# EAGLE design JCarlos e Renato (EAGLE 6.2)
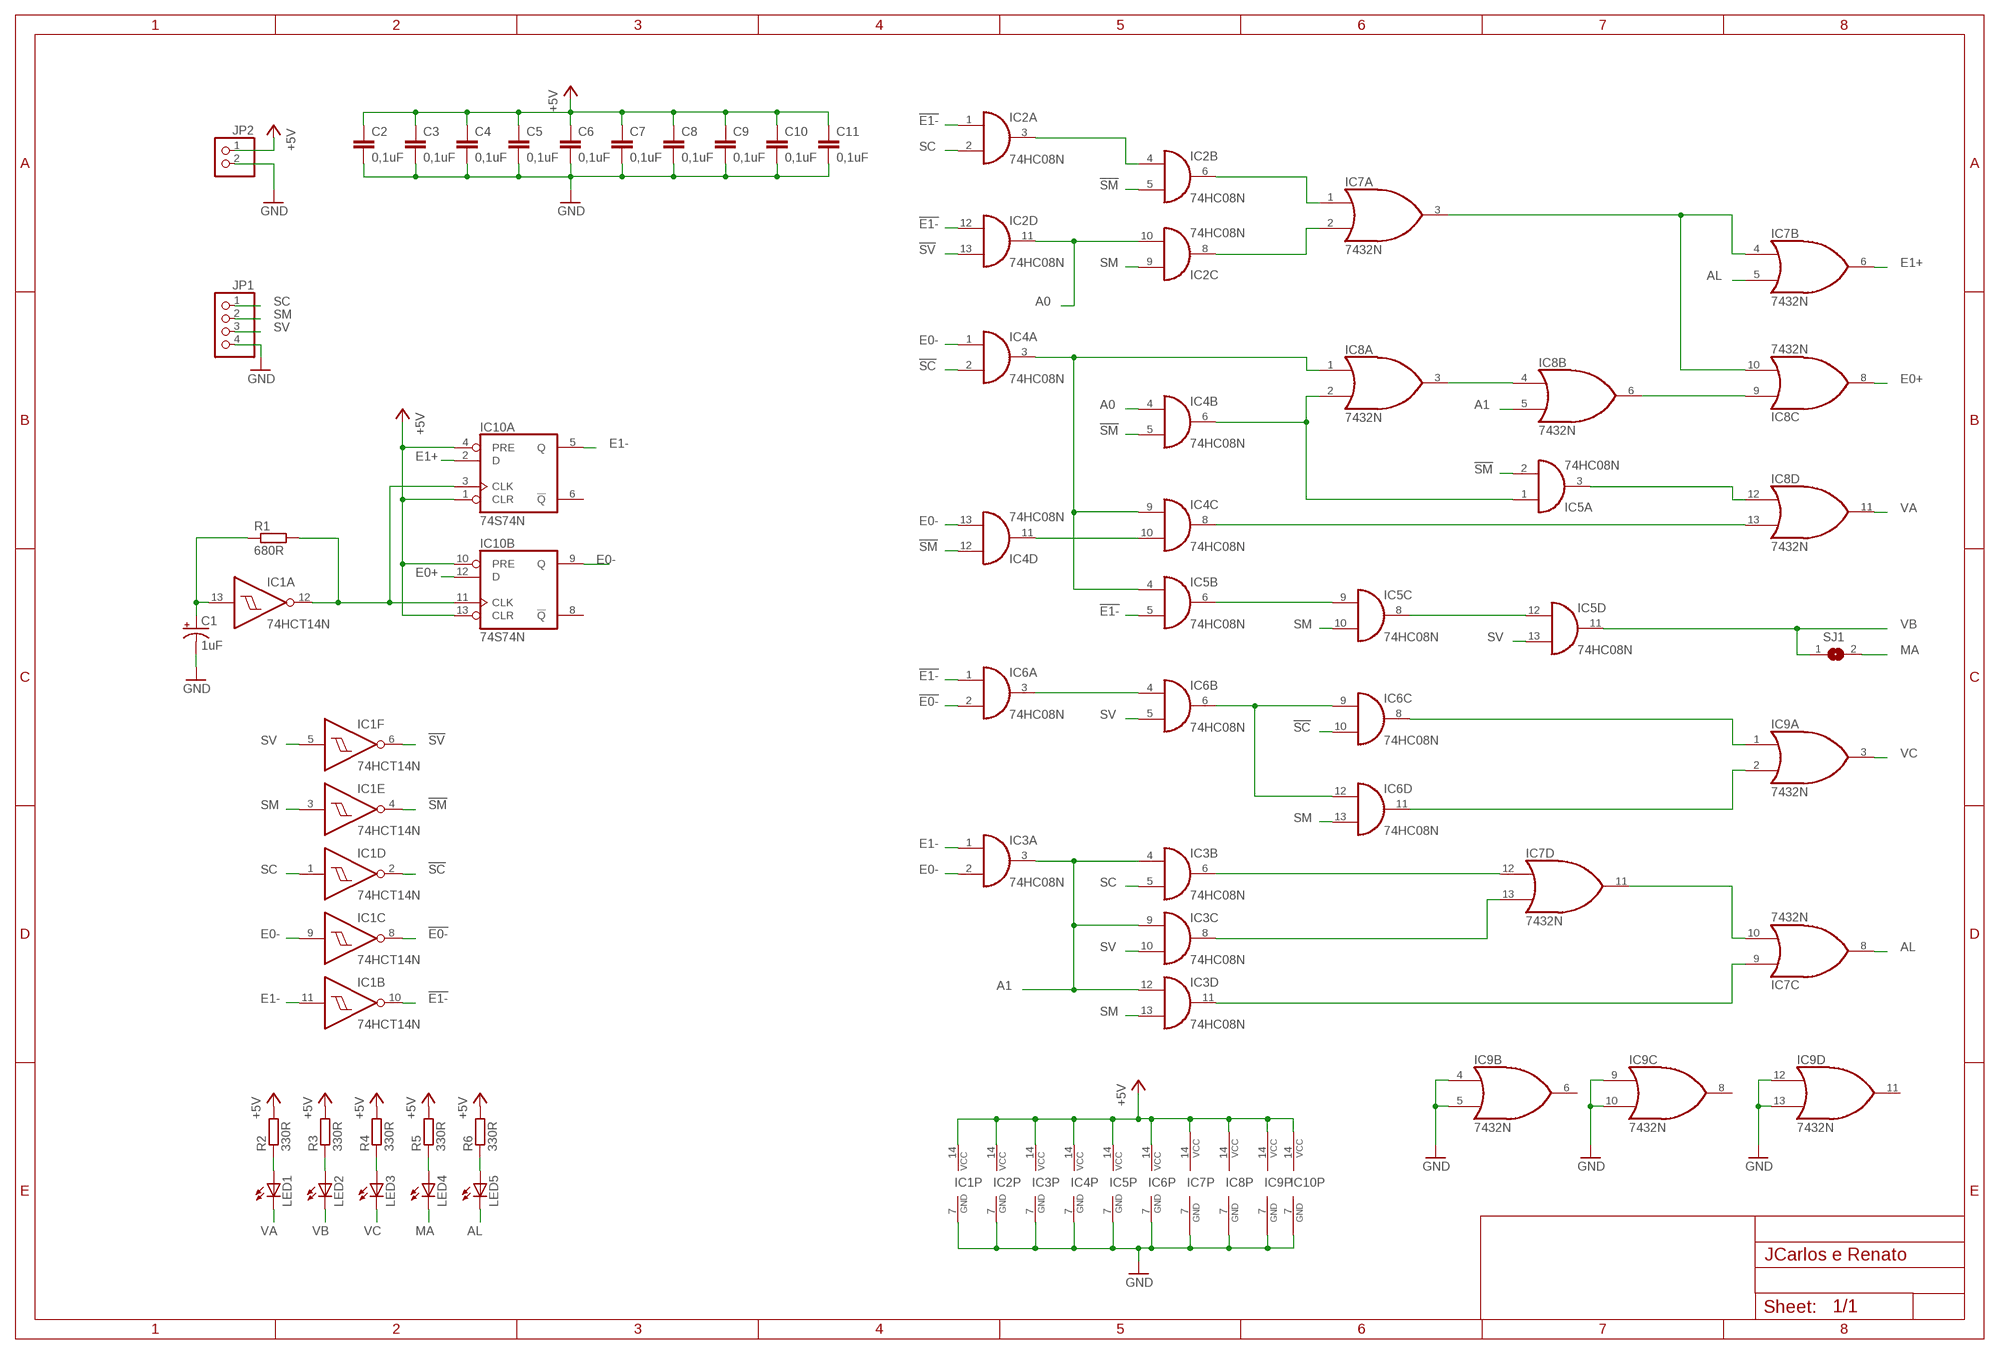
[diagram p0: schematic, sheet 1]

## Parts
C1  1uF  CPOL-USE5-6  [E5-6]
C2  0,1uF  C-EU050-025X075  [C050-025X075]
C3  0,1uF  C-EU050-025X075  [C050-025X075]
C4  0,1uF  C-EU050-025X075  [C050-025X075]
C5  0,1uF  C-EU050-025X075  [C050-025X075]
C6  0,1uF  C-EU050-025X075  [C050-025X075]
C7  0,1uF  C-EU050-025X075  [C050-025X075]
C8  0,1uF  C-EU050-025X075  [C050-025X075]
C9  0,1uF  C-EU050-025X075  [C050-025X075]
C10  0,1uF  C-EU050-025X075  [C050-025X075]
C11  0,1uF  C-EU050-025X075  [C050-025X075]
IC1  74HCT14N  [DIL14]
IC2  74HC08N  [DIL14]
IC3  74HC08N  [DIL14]
IC4  74HC08N  [DIL14]
IC5  74HC08N  [DIL14]
IC6  74HC08N  [DIL14]
IC7  7432N  [DIL14]
IC8  7432N  [DIL14]
IC9  7432N  [DIL14]
IC10  74S74N  [DIL14]
JP1  PINHD-1X4  [1X04]
JP2  PINHD-1X2  [1X02]
LED1  LED5MM  [LED5MM]
LED2  LED5MM  [LED5MM]
LED3  LED5MM  [LED5MM]
LED4  LED5MM  [LED5MM]
LED5  LED5MM  [LED5MM]
R1  680R  R-EU_0204/5  [0204/5]
R2  330R  R-EU_0207/10  [0207/10]
R3  330R  R-EU_0207/10  [0207/10]
R4  330R  R-EU_0207/10  [0207/10]
R5  330R  R-EU_0207/10  [0207/10]
R6  330R  R-EU_0207/10  [0207/10]
SJ1  SJ  [SJ]

## Nets
!E0-: IC1.8(C:O) IC6.2(A:I1)
!E1-: IC1.10(B:O) IC2.1(A:I0) IC2.12(D:I0) IC5.5(B:I1) IC6.1(A:I0)
!SC: IC1.2(D:O) IC4.2(A:I1) IC6.10(C:I1)
!SM: IC1.4(E:O) IC2.5(B:I1) IC4.5(B:I1) IC4.12(D:I0) IC5.2(A:I1)
!SV: IC1.6(F:O) IC2.13(D:I1)
+5V: C2.1 C3.1 C4.1 C5.1 C6.1 C7.1 C8.1 C9.1 C10.1 C11.1 IC1.14(P:VCC) IC2.14(P:VCC) IC3.14(P:VCC) IC4.14(P:VCC) IC5.14(P:VCC) IC6.14(P:VCC) IC7.14(P:VCC) IC8.14(P:VCC) IC9.14(P:VCC) IC10.1(A:CLR) IC10.4(A:PRE) IC10.10(B:PRE) IC10.13(B:CLR) IC10.14(P:VCC) JP2.1 R2.2 R3.2 R4.2 R5.2 R6.2
A0: IC2.10(C:I1) IC2.11(D:O) IC4.4(B:I0)
A1: IC3.3(A:O) IC3.4(B:I0) IC3.9(C:I0) IC3.12(D:I0) IC8.5(B:I1)
AL: IC7.5(B:I1) IC7.8(C:O) LED5.K(C)
E0+: IC8.8(C:O) IC10.12(B:D)
E0-: IC1.9(C:I) IC3.2(A:I1) IC4.1(A:I0) IC4.13(D:I1) IC10.9(B:Q)
E1+: IC7.6(B:O) IC10.2(A:D)
E1-: IC1.11(B:I) IC3.1(A:I0) IC10.5(A:Q)
GND: C1.- C2.2 C3.2 C4.2 C5.2 C6.2 C7.2 C8.2 C9.2 C10.2 C11.2 IC1.7(P:GND) IC2.7(P:GND) IC3.7(P:GND) IC4.7(P:GND) IC5.7(P:GND) IC6.7(P:GND) IC7.7(P:GND) IC8.7(P:GND) IC9.4(B:I0) IC9.5(B:I1) IC9.7(P:GND) IC9.9(C:I0) IC9.10(C:I1) IC9.12(D:I0) IC9.13(D:I1) IC10.7(P:GND) JP1.4 JP2.2
MA: LED4.K(C) SJ1.2
N$1: IC5.6(B:O) IC5.9(C:I0)
N$2: IC7.3(A:O) IC7.4(B:I0) IC8.10(C:I1)
N$3: IC4.10(C:I1) IC4.11(D:O)
N$4: IC4.8(C:O) IC8.13(D:I1)
N$5: IC8.3(A:O) IC8.4(B:I0)
N$6: IC5.3(A:O) IC8.12(D:I0)
N$7: C1.+ IC1.13(A:I) R1.1
N$8: IC1.12(A:O) IC10.3(A:CLK) IC10.11(B:CLK) R1.2
N$9: IC8.6(B:O) IC8.9(C:I0)
N$10: IC4.3(A:O) IC4.9(C:I0) IC5.4(B:I0) IC8.1(A:I0)
N$11: IC5.8(C:O) IC5.12(D:I0)
N$12: IC4.6(B:O) IC5.1(A:I0) IC8.2(A:I1)
N$13: IC2.3(A:O) IC2.4(B:I0)
N$14: LED1.A R2.1
N$15: IC2.6(B:O) IC7.1(A:I0)
N$16: LED2.A R3.1
N$17: LED3.A R4.1
N$18: IC2.8(C:O) IC7.2(A:I1)
N$19: IC3.6(B:O) IC7.12(D:I0)
N$20: IC3.8(C:O) IC7.13(D:I1)
N$21: IC3.11(D:O) IC7.9(C:I0)
N$22: IC7.10(C:I1) IC7.11(D:O)
N$23: LED4.A R5.1
N$24: LED5.A R6.1
N$27: IC6.3(A:O) IC6.4(B:I0)
N$29: IC6.6(B:O) IC6.9(C:I0) IC6.12(D:I0)
N$32: IC6.8(C:O) IC9.1(A:I0)
N$33: IC6.11(D:O) IC9.2(A:I1)
SC: IC1.1(D:I) IC2.2(A:I1) IC3.5(B:I1) JP1.1
SM: IC1.3(E:I) IC2.9(C:I0) IC3.13(D:I1) IC5.10(C:I1) IC6.13(D:I1) JP1.2
SV: IC1.5(F:I) IC3.10(C:I1) IC5.13(D:I1) IC6.5(B:I1) JP1.3
VA: IC8.11(D:O) LED1.K(C)
VB: IC5.11(D:O) LED2.K(C) SJ1.1
VC: IC9.3(A:O) LED3.K(C)
Unconnected: IC9.6(B:O) IC9.8(C:O) IC9.11(D:O) IC10.6(A:!Q) IC10.8(B:!Q)

## Library data of the parts
C1 = rcl:CPOL-US: POLARIZED CAPACITOR, American symbol; E5-6: E5-6
C2-C11 = rcl:C-EU: CAPACITOR, European symbol
IC1 = 74xx-eu:74*14: Hex schmitt trigger INVERTER
IC2-IC6 = 74xx-eu:74*08: Quad 2-input AND gate
IC7-IC9 = 74xx-us:74*32: Quad 2-input OR gate
IC10 = 74xx-us:74*74: Dual D type positive edge triggered FLIP FLOP, preset and clear
JP1 = pinhead:PINHD-1X4: PIN HEADER
JP2 = pinhead:PINHD-1X2: PIN HEADER
LED1-LED5 = led:LED: LED OSRAM: - CHIPLED LG R971, LG N971, LY N971, LG Q971, LY Q971, LO R971, LY R971 LH N974, LH R974 LS Q976, LO Q976, LY Q976 LO Q996 - Hyper CHIPLED LW Q18S LB Q993, LB Q99A, LB R99A - SideLED LS A670, LO A670, LY A670, LG A670, LP A670 LB A673, LV A673, LT A673, LW A673 LH A674 LY A675 LS A676, LA A676, LO A676, LY A676, LW A676 LS A679, LY A679, LG A679 - Hyper Micro SIDELED® LS Y876, LA Y876, LO Y876, LY Y876 LT Y87S - SmartLED LW L88C, LW L88S LB L89C, LB L89S, LG L890 LS L89K, LO L89K, LY L89K LS L896, LA L896, LO L896, LY L896 - TOPLED LS T670, LO T670, LY T670, LG T670, LP T670 LSG T670, LSP T670, LSY T670, LOP T670, LYG T670 LG T671, LOG T671, LSG T671 LB T673, LV T673, LT T673, LW T673 LH T674 LS T676, LA T676, LO T676, LY T676, LB T676, LH T676, LSB T676, LW T676 LB T67C, LV T67C, LT T67C, LS T67K, LO T67K, LY T67K, LW E67C LS E67B, LA E67B, LO E67B, LY E67B, LB E67C, LV E67C, LT E67C LW T67C LS T679, LY T679, LG T679 LS T770, LO T770, LY T770, LG T770, LP T770 LB T773, LV T773, LT T773, LW T773 LH T774 LS E675, LA E675, LY E675, LS T675 LS T776, LA T776, LO T776, LY T776, LB T776 LHGB T686 LT T68C, LB T68C - Hyper Mini TOPLED® LB M676 - Mini TOPLED Santana® LG M470 LS M47K, LO M47K, LY M47K Source: http://www.osram.convergy.de LUXEON: - LUMILED® LXK2-PW12-R00, LXK2-PW12-S00, LXK2-PW14-U00, LXK2-PW14-V00 LXK2-PM12-R00, LXK2-PM12-S00, LXK2-PM14-U00 LXK2-PE12-Q00, LXK2-PE12-R00, LXK2-PE12-S00, LXK2-PE14-T00, LXK2-PE14-U00 LXK2-PB12-K00, LXK2-PB12-L00, LXK2-PB12-M00, LXK2-PB14-N00, LXK2-PB14-P00, LXK2-PB14-Q00 LXK2-PR12-L00, LXK2-PR12-M00, LXK2-PR14-Q00, LXK2-PR14-R00 LXK2-PD12-Q00, LXK2-PD12-R00, LXK2-PD12-S00 LXK2-PH12-R00, LXK2-PH12-S00 LXK2-PL12-P00, LXK2-PL12-Q00, LXK2-PL12-R00 Source: www.luxeon.com KINGBRIGHT: KA-3528ASYC Source: www.kingbright.com
R1-R6 = rcl:R-EU_: RESISTOR, European symbol
SJ1 = jumper:SJ: SMD solder JUMPER

## Board
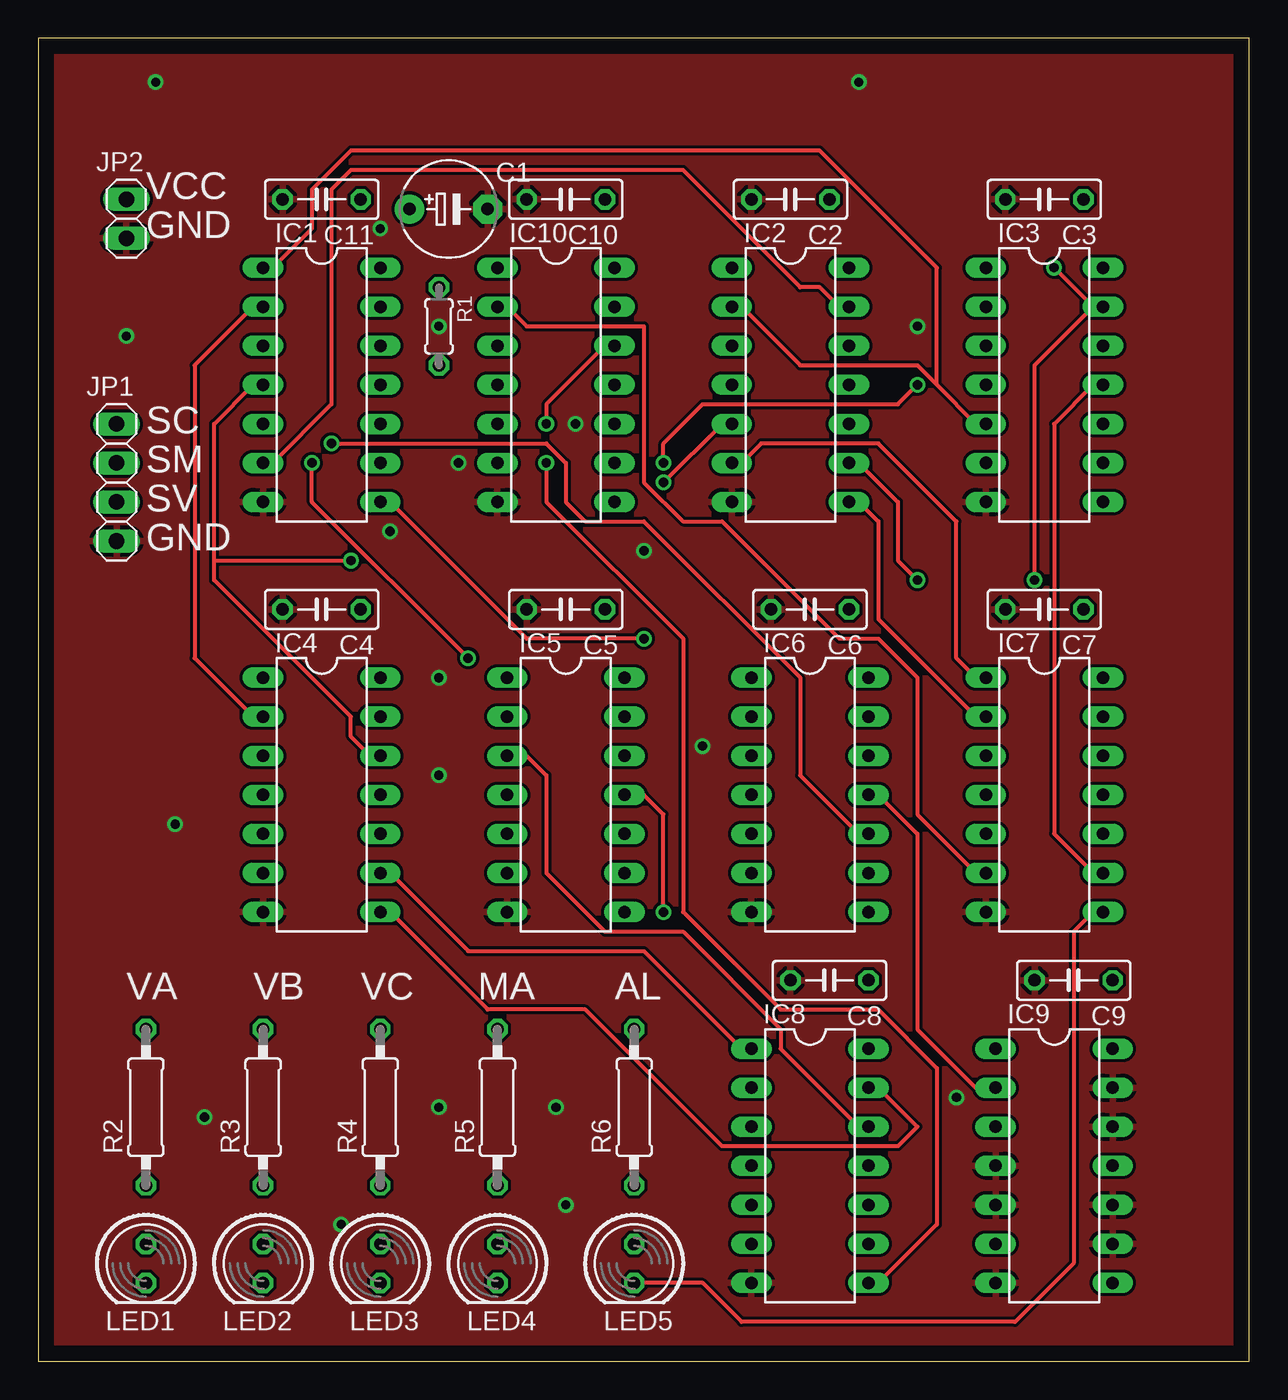
[diagram p1: board, top side]
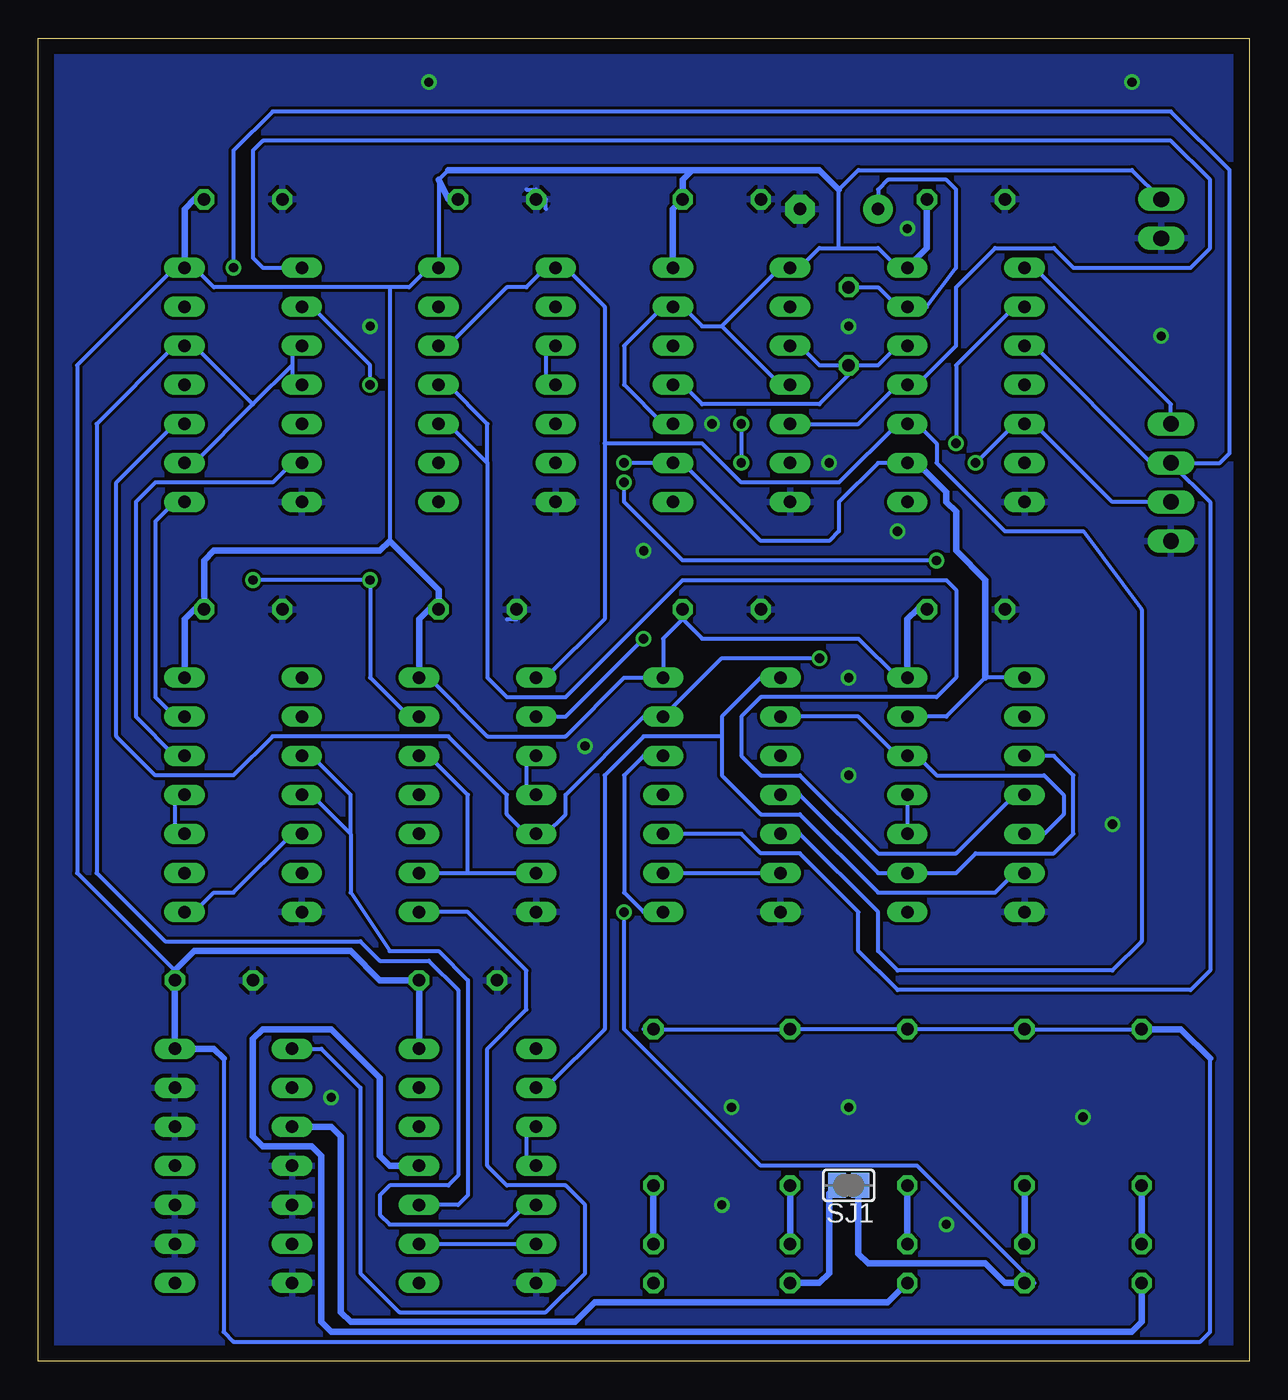
[diagram p2: board, bottom side, seen from below]

Size 78.72 x 86.03 mm. Coordinates in mm from the lower left corner, seen from the top.
Outline: 0,0 78.72,0 78.72,86.03 0,86.03 0,0
Copper layers (1*16): Top 0.035mm / dielectric 1.5mm / Bottom 0.035mm
Design rules: minimum track width 10mil, minimum drill 24mil, track to track 8mil, track to pad 8mil, pad to pad 8mil, via to via 8mil, smd to smd 8mil, copper to edge 40mil, drill to drill 8mil, minimum pad ring 10mil, minimum via ring 8mil, stop-mask expansion 4mil, vias tented up to drill 0mil, thermal gap 10mil

### Footprints (pad centres in the part's own frame; a part is rotated, then mirrored left to right if it is on the bottom)
E5-6 = drill 0.813 pad 1.905: + -2.54,0 | drill 0.813 pad 1.905 octagon: - 2.54,0
C050-025X075 = drill 0.813 octagon: 1 -2.54,0; 2 2.54,0
DIL14 = drill 0.813 long: 1 -7.62,-3.81; 2 -5.08,-3.81; 3 -2.54,-3.81; 4 0,-3.81; 5 2.54,-3.81; 6 5.08,-3.81; 7 7.62,-3.81; 8 7.62,3.81; 9 5.08,3.81; 10 2.54,3.81; 11 0,3.81; 12 -2.54,3.81; 13 -5.08,3.81; 14 -7.62,3.81
1X04 = drill 1.016 long: 1 -3.81,0; 2 -1.27,0; 3 1.27,0; 4 3.81,0
1X02 = drill 1.016 long: 1 -1.27,0; 2 1.27,0
LED5MM = drill 0.813 octagon: A -1.27,0; K 1.27,0
0204/5 = drill 0.813 octagon: 1 -2.54,0; 2 2.54,0
0207/10 = drill 0.813 octagon: 1 -5.08,0; 2 5.08,0
SJ = smd 1.168 x 1.6: 1 -0.762,0; 2 0.762,0

### Placement (x,y rotation side)
C1  26.67,74.93 0 top
C2  48.9,75.56 180 top
C3  65.41,75.56 180 top
C4  18.41,48.9 180 top
C5  34.29,48.9 180 top
C6  50.16,48.9 180 top
C7  65.41,48.9 180 top
C8  51.44,24.77 180 top
C9  67.31,24.77 180 top
C10  34.29,75.56 180 top
C11  18.41,75.56 180 top
IC1  18.41,63.5 270 top
IC2  48.9,63.5 270 top
IC3  65.41,63.5 270 top
IC4  18.41,36.83 270 top
IC5  34.29,36.83 270 top
IC6  50.16,36.83 270 top
IC7  65.41,36.83 270 top
IC8  50.16,12.7 270 top
IC9  66.04,12.7 270 top
IC10  33.66,63.5 270 top
JP1  5.08,57.15 270 top
JP2  5.71,74.3 270 top
LED1  6.99,6.35 270 top
LED2  14.61,6.35 270 top
LED3  22.23,6.35 270 top
LED4  29.84,6.35 270 top
LED5  38.73,6.35 270 top
R1  26.04,67.31 270 top
R2  6.99,16.51 90 top
R3  14.61,16.51 90 top
R4  22.23,16.51 90 top
R5  29.84,16.51 90 top
R6  38.73,16.51 90 top
SJ1  26.04,11.43 180 bottom

### Tracks (layer width: path | path; a pad name or v marks a point on that pad's centre or on a via)
!E0-  (via drill 0.61)
  Top 0.254: v39.37,46.99 31.75,46.99 22.86,55.88 IC1.8
  Bottom 0.254: v39.37,46.99 44.45,41.91 IC6.2
!E1-
  Bottom 0.254: 41.91,59.69 41.91,68.58 44.45,71.12 IC2.1 45.72,71.12 46.99,69.85 48.26,69.85 52.07,66.04 IC2.12 | 41.91,59.69 41.91,48.26 45.72,44.45 IC6.1 | IC5.5 29.21,34.29 24.13,29.21 24.13,26.67 22.86,25.4 8.89,25.4 6.99,27.3 6.99,48.9 10.79,53.98 15.88,53.98 20.32,58.42 20.32,59.69 21.59,60.96 IC1.10 22.86,60.96 26.67,57.15 33.02,57.15 35.56,59.69 41.91,59.69
!SC  (via drill 0.61)
  Top 0.254: IC4.2 13.97,41.91 10.16,45.72 10.16,64.77 13.97,68.58 IC1.2 | v19.05,59.69 33.02,59.69 34.29,58.42 34.29,55.88 35.56,54.61 39.37,54.61 49.53,44.45 49.53,38.1 53.34,34.29 IC6.10
  Bottom 0.254: v19.05,59.69 19.05,64.77 15.24,68.58 IC1.2
!SM  (via drill 0.61)
  Top 0.254: 11.43,52.07 11.43,50.8 20.32,41.91 20.32,40.64 21.59,39.37 IC4.12 | 11.43,52.07 11.43,60.96 13.97,63.5 IC1.4 | v40.64,57.15 44.45,60.96 IC2.5 | 11.43,52.07 v20.32,52.07
  Bottom 0.254: IC4.5 13.34,34.29 12.06,35.56 12.06,36.83 13.34,38.1 20.32,38.1 21.59,39.37 IC4.12 22.86,39.37 25.4,41.91 IC5.2 | v40.64,57.15 40.64,55.88 36.83,52.07 v20.32,52.07
!SV
  Top 0.254: IC1.6 15.24,58.42 19.05,62.23 19.05,76.2 20.32,77.47 41.91,77.47 49.53,69.85 50.8,69.85 52.07,68.58 IC2.13
+5V
  Bottom 0.254: 34.29,67.31 30.48,63.5 IC10.4 | 34.29,67.31 35.56,67.31 36.83,68.58 IC10.13 38.1,68.58 40.64,66.04 40.64,63.5 38.1,60.96 IC10.10 | 26.67,72.39 27.94,72.39 29.21,71.12 IC10.1 30.48,71.12 34.29,67.31 | 26.67,72.39 24.13,72.39 22.86,71.12 IC1.14 | JP2.1 7.62,77.47 25.4,77.47 26.67,76.2 26.67,72.39 | R2.2 R3.2 R4.2 R5.2 R6.2 39.37,21.59 | 36.83,48.26 35.56,46.99 25.4,46.99 22.86,44.45 IC4.14 | 36.83,48.26 38.1,46.99 IC5.14 40.64,44.45 44.45,40.64 49.53,40.64 53.34,44.45 IC6.14 | 36.83,48.26 C5.1 | 69.85,24.13 C9.1 | 52.07,77.47 52.7,76.83 IC2.14 53.34,71.12 54.61,69.85 55.88,69.85 | 55.88,69.85 67.31,69.85 68.58,71.12 IC3.14 69.85,71.12 76.2,64.77 76.2,31.75 69.85,25.4 | 55.88,69.85 55.88,53.34 | 2.54,19.68 2.54,1.91 3.17,1.27 66.04,1.27 66.67,1.91 66.67,19.68
  Bottom 0.406: C3.1 68.58,75.56 69.22,74.93 IC3.14 | C2.1 52.07,75.56 52.7,76.83 | C11.1 20.95,72.39 IC1.14 | 52.07,77.47 36.2,77.47 | 36.2,77.47 27.94,77.47 26.67,76.2 | 36.2,77.47 36.83,76.83 C10.1 37.47,74.93 IC10.14 | IC6.14 53.98,48.26 53.34,48.9 C6.1 52.7,50.16 55.88,53.34 56.52,52.7 67.31,52.7 67.94,52.07 C7.1 68.58,48.9 69.22,48.26 IC7.14 | C4.1 21.59,48.9 22.23,48.26 IC4.14 | IC8.14 C8.1 56.52,24.77 58.42,26.67 68.58,26.67 69.85,25.4 C9.1 | 69.85,24.13 IC9.14 67.31,20.32 66.67,19.68 | 2.54,19.68 4.45,21.59 R2.2
A0
  Bottom 0.254: 49.53,58.42 49.53,44.45 48.26,43.18 44.45,43.18 36.83,50.8 19.68,50.8 19.05,50.16 19.05,44.45 20.32,43.18 31.75,43.18 33.02,41.91 33.02,39.37 31.75,38.1 29.21,38.1 24.13,33.02 19.05,33.02 15.24,36.83 IC4.4 | 49.53,58.42 52.07,60.96 IC2.10 | 49.53,58.42 49.53,60.96 52.07,63.5 IC2.11
A1
  Bottom 0.254: 62.23,64.77 62.23,66.04 IC3.3 | 62.23,64.77 62.23,63.5 IC3.4 | 62.23,64.77 64.77,62.23 | 64.77,62.23 68.58,58.42 IC3.9 | IC8.5 46.99,10.16 48.26,8.89 55.88,8.89 56.52,9.53 56.52,10.79 55.88,11.43 52.07,11.43 51.44,12.06 51.44,24.13 53.34,26.04 56.52,26.04 57.78,27.3 70.48,27.3 74.93,31.75 74.93,60.96 69.85,66.04 IC3.12 68.58,66.04 64.77,62.23
AL
  Top 0.254: LED5.K 43.18,5.08 45.72,2.54 63.5,2.54 67.31,6.35 67.31,27.94 68.58,29.21 IC7.8
  Bottom 0.254: IC7.5 62.23,34.29 66.04,30.48 67.31,30.48 68.58,29.21 IC7.8
E0+  (via drill 0.61)
  Top 0.254: v33.02,58.42 33.02,55.88 41.91,46.99 41.91,29.21 48.26,22.86 54.61,22.86 58.42,19.05 58.42,8.89 54.61,5.08 IC8.8 | v33.02,60.96 33.02,62.23 36.83,66.04 IC10.12
  Bottom 0.254: v33.02,60.96 v33.02,58.42
E0-  (via drill 0.61)
  Top 0.254: v57.15,63.5 55.88,62.23 43.18,62.23 40.64,59.69 v40.64,58.42
  Bottom 0.254: IC4.13 19.68,41.91 17.14,44.45 IC4.1 15.24,44.45 | 21.59,58.42 IC1.9 24.13,58.42 26.67,55.88 26.67,53.98 27.3,53.34 31.75,53.34 36.83,58.42 IC10.9 v40.64,58.42 | v57.15,63.5 57.15,64.77 60.96,68.58 IC3.2
  Bottom 0.406: 21.59,58.42 19.68,56.52 19.68,55.88 19.05,55.24 19.05,52.7 17.14,50.8 17.14,44.45
E1+
  Top 0.254: IC7.6 60.96,31.75 57.15,35.56 57.15,44.45 54.61,46.99 52.07,46.99 44.45,54.61 41.91,54.61 39.37,57.15 39.37,67.31 31.75,67.31 30.48,68.58 IC10.2
E1-
  Bottom 0.254: IC10.5 25.4,60.96 22.86,63.5 IC1.11 21.59,63.5 19.05,66.04 19.05,69.85 16.51,72.39 12.7,72.39 11.43,71.12 3.81,71.12 2.54,72.39 2.54,76.83 5.08,79.38 64.14,79.38 64.77,78.74 64.77,71.75 64.14,71.12 IC3.1
GND  (via drill 0.6)
  Bottom 0.254: 29.21,55.88 IC10.7 30.48,55.88 | 48.26,48.26 47.62,48.26 | 46.99,76.2 46.35,76.2 | 45.72,74.93 45.72,75.56 | C1.-
  other vias: 8.89,34.92 10.79,15.88 26.04,16.51 33.66,16.51 34.29,10.16 5.71,66.67 53.34,83.19 7.62,83.19 26.04,38.1 26.04,44.45 22.86,53.98 39.37,52.7 43.18,40.01 59.69,17.14 19.68,8.89 22.23,73.66 26.04,67.31 34.92,60.96 57.15,67.31 27.3,58.42
  pour Bottom: -1.91,87 79.38,87 80.01,-1.27 -1.27,-1.27
  pour Top: -0.64,86.36 79.38,86.36 79.38,-0.64 -0.64,-0.64
MA
  Bottom 0.406: SJ1.2 27.3,10.92 27.3,5.71 27.94,5.08 LED4.K
N$1
  Bottom 0.254: IC5.9 IC5.6
N$2
  Bottom 0.254: 58.42,34.29 58.42,30.48 55.88,26.67 52.7,26.67 50.8,24.77 50.8,10.79 51.44,10.16 IC8.10 | 58.42,34.29 60.96,36.83 IC7.4 | 58.42,34.29 58.42,36.83 60.96,39.37 IC7.3
N$3
  Bottom 0.254: IC4.11 IC4.10
N$4
  Top 0.254: IC4.8 22.86,29.21 29.21,22.86 35.56,22.86 44.45,13.97 55.88,13.97 57.15,15.24 54.61,17.78 IC8.13
N$5
  Bottom 0.254: IC8.4 46.99,12.7 46.99,15.24 IC8.3
N$6
  Top 0.254: IC5.3 31.75,39.37 33.02,38.1 33.02,31.75 36.83,27.94 41.91,27.94 48.26,21.59 48.26,20.32 53.34,15.24 IC8.12
N$7
  Bottom 0.254: R1.1 24.13,69.85 22.86,68.58 IC1.13 20.95,68.58 19.05,71.12 19.05,76.2 19.68,76.83 23.5,76.83 24.13,76.2 C1.+
N$8
  Bottom 0.254: IC10.3 29.21,66.04 27.94,64.77 R1.2 25.4,64.77 | 25.4,64.77 27.94,62.23 35.56,62.23 36.83,63.5 IC10.11 | 25.4,64.77 24.13,64.77 22.86,66.04 IC1.12
N$9
  Bottom 0.254: IC8.9 IC8.6
N$10
  Top 0.254: IC8.1 45.72,20.32 39.37,26.67 27.94,26.67 22.86,31.75 IC4.9
  Bottom 0.254: IC5.4 29.21,36.83 24.13,31.75 IC4.9 19.05,31.75 17.78,33.02 12.7,33.02 11.43,34.29 11.43,38.1 12.7,39.37 IC4.3
N$11
  Bottom 0.254: IC5.8 39.37,29.21 40.64,30.48 40.64,38.1 39.37,39.37 IC5.12
N$12
  Bottom 0.254: 34.29,40.64 34.29,41.91 31.75,44.45 IC5.1 | 34.29,40.64 34.29,38.1 31.75,35.56 29.21,35.56 24.13,30.48 16.51,30.48 15.24,31.75 IC4.6 | 34.29,40.64 39.37,40.64 41.91,38.1 41.91,21.59 45.72,17.78 IC8.2
N$13
  Bottom 0.254: IC2.4 45.72,63.5 45.72,66.04 IC2.3
N$14
  Bottom 0.406: R2.1 LED1.A
N$15
  Top 0.254: IC2.6 45.72,58.42 46.99,59.69 54.61,59.69 59.69,54.61 59.69,45.72 60.96,44.45 IC7.1
N$16
  Bottom 0.406: R3.1 LED2.A
N$17
  Bottom 0.406: R4.1 LED3.A
N$18
  Top 0.254: IC7.2 60.96,41.91 54.61,48.26 54.61,54.61 53.34,55.88 IC2.8
N$19
  Bottom 0.254: IC7.12 69.85,39.37 72.39,41.91 72.39,55.88 71.12,57.15 63.5,57.15 62.23,58.42 IC3.6
N$20
  Bottom 0.254: IC7.13 69.85,41.91 71.12,43.18 71.12,54.61 69.85,55.88 IC3.8
N$21
  Top 0.254: IC7.9 68.58,31.75 66.04,34.29 66.04,60.96 68.58,63.5 IC3.11
N$22
  Bottom 0.254: IC7.10 69.85,34.29 69.85,36.83 IC7.11
N$23
  Bottom 0.406: R5.1 LED4.A
N$24
  Bottom 0.406: R6.1 LED5.A
N$27
  Bottom 0.254: IC6.4 46.99,36.83 46.99,39.37 IC6.3
N$29
  Bottom 0.254: IC6.9 50.8,31.75 | 50.8,31.75 IC6.6 | 50.8,31.75 50.8,36.83 53.34,39.37 IC6.12
N$32
  Bottom 0.254: IC9.1 60.33,20.32 57.78,17.78 57.78,5.71 55.24,3.17 45.72,3.17 43.18,5.71 43.18,10.16 44.45,11.43 48.26,11.43 49.53,12.7 49.53,20.32 46.99,22.86 46.99,25.4 50.8,29.21 IC6.8
N$33
  Top 0.254: IC9.2 60.96,17.78 57.15,21.59 57.15,34.29 54.61,36.83 IC6.11
SC
  Top 0.254: 58.42,63.5 57.15,64.77 49.53,64.77 45.72,68.58 IC2.2 | 58.42,63.5 60.96,60.96 IC3.5 | 58.42,63.5 58.42,71.12 50.8,78.74 20.32,78.74 17.78,76.2 17.78,73.66 15.24,71.12 IC1.1
  Bottom 0.254: JP1.1 5.08,62.23 13.97,71.12 IC1.1
SM  (via drill 0.61)
  Top 0.254: v57.15,50.8 55.88,52.07 55.88,55.88 53.34,58.42 IC2.9 | 68.58,68.58 64.77,64.77 v64.77,50.8 | v66.04,71.12 68.58,68.58 | 68.58,68.58 IC3.13
  Bottom 0.254: JP1.2 6.35,58.42 13.97,66.04 IC1.3 | IC5.10 33.02,34.29 31.75,33.02 29.21,33.02 25.4,29.21 25.4,26.67 22.86,24.13 3.81,24.13 2.54,25.4 2.54,55.88 JP1.2 | IC6.13 54.61,41.91 57.15,44.45 v57.15,50.8 v64.77,50.8 | v66.04,71.12 66.04,78.74 63.5,81.28 5.08,81.28 1.27,77.47 1.27,59.05 1.91,58.42 JP1.2
SV  (via drill 0.61)
  Top 0.254: v17.78,58.42 17.78,55.88 v27.94,45.72
  Bottom 0.254: IC3.10 69.85,60.96 73.66,57.15 73.66,40.64 71.12,38.1 66.04,38.1 63.5,40.64 52.07,40.64 48.26,36.83 48.26,35.56 46.99,34.29 IC6.5 45.72,34.29 44.45,35.56 44.45,36.83 39.37,41.91 IC5.13 34.29,45.72 v27.94,45.72 | JP1.3 8.89,55.88 13.97,60.96 IC1.5 15.24,60.96 v17.78,58.42
VA
  Bottom 0.406: LED1.K 6.99,2.54 7.62,1.91 59.69,1.91 60.33,2.54 60.33,13.34 60.96,13.97 64.14,13.97 64.77,14.61 64.77,20.95 64.14,21.59 59.69,21.59 56.52,18.41 56.52,13.34 55.88,12.7 IC8.11
VB  (via drill 0.61)
  Top 0.254: IC5.11 39.37,36.83 40.64,35.56 v40.64,29.21
  Bottom 0.254: v40.64,29.21 40.64,21.59 31.75,12.7 21.59,12.7 13.97,5.08 LED2.K
  Bottom 0.406: SJ1.1 25.4,11.3 25.4,6.99 24.77,6.35 17.14,6.35 15.88,5.08 LED2.K
VC
  Bottom 0.406: LED3.K 23.5,3.81 42.55,3.81 43.81,2.54 58.42,2.54 59.05,3.17 59.05,14.61 59.69,15.24 IC9.3

### Text on the board
tNames: VCC | GND | SC | SM | SV | GND | VA | VB | VC | MA | AL